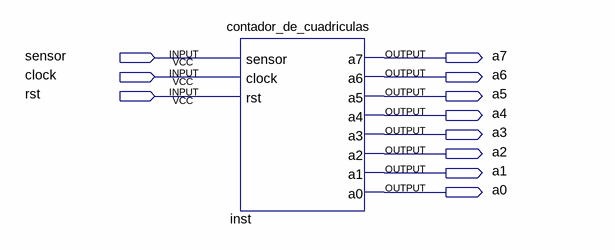
[diagram p0: schematic sheet]
// Quartus schematic contadorcuadriculas.bdf as structural Verilog: 1 symbols, 11 pins
module contadorcuadriculas (
  input  sensor,
  input  clock,
  input  rst,
  output a7,
  output a6,
  output a5,
  output a4,
  output a3,
  output a2,
  output a1,
  output a0
);

  contador_de_cuadriculas inst (
    .sensor(sensor), .clock(clock), .rst(rst), .a7(a7), .a6(a6), .a5(a5), .a4(a4), .a3(a3), .a2(a2), .a1(a1),
    .a0(a0));
endmodule
